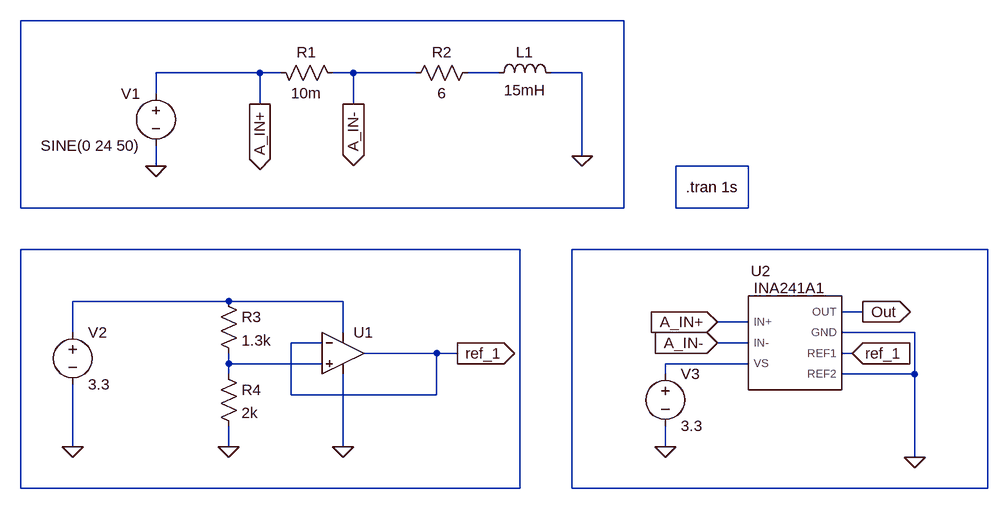
[diagram p0: schematic schematic.asc]
schematic.asc, the LTspice schematic file:
Version 4.1
SHEET 1 1492 788
WIRE 800 48 -128 48
WIRE 240 128 80 128
WIRE 272 128 240 128
WIRE 384 128 352 128
WIRE 480 128 384 128
WIRE 608 128 560 128
WIRE 736 128 688 128
WIRE 80 160 80 128
WIRE 240 176 240 128
WIRE 384 176 384 128
WIRE 736 256 736 128
WIRE 80 272 80 240
WIRE 992 272 880 272
WIRE -128 336 -128 48
WIRE 800 336 800 48
WIRE 800 336 -128 336
WIRE 880 336 880 272
WIRE 992 336 992 272
WIRE 992 336 880 336
WIRE 640 400 -128 400
WIRE 1360 400 720 400
WIRE 192 480 -48 480
WIRE 368 480 192 480
WIRE 1168 496 1136 496
WIRE 992 512 944 512
WIRE -48 528 -48 480
WIRE 368 528 368 480
WIRE 1248 528 1136 528
WIRE 336 544 288 544
WIRE 992 544 944 544
WIRE 512 560 400 560
WIRE 544 560 512 560
WIRE 1152 560 1136 560
WIRE 192 576 192 560
WIRE 336 576 192 576
WIRE 992 576 864 576
WIRE 192 592 192 576
WIRE 864 592 864 576
WIRE 1248 592 1248 528
WIRE 1248 592 1136 592
WIRE 288 624 288 544
WIRE 512 624 512 560
WIRE 512 624 288 624
WIRE -48 704 -48 608
WIRE 192 704 192 672
WIRE 368 704 368 592
WIRE 864 704 864 672
WIRE 1248 720 1248 592
WIRE -128 768 -128 400
WIRE 640 768 640 400
WIRE 640 768 -128 768
WIRE 720 768 720 400
WIRE 1360 768 1360 400
WIRE 1360 768 720 768
FLAG 80 272 0
FLAG 736 256 0
FLAG 240 176 A_IN+
IOPIN 240 176 Out
FLAG 384 176 A_IN-
IOPIN 384 176 Out
FLAG -48 704 0
FLAG 192 704 0
FLAG 544 560 ref_1
IOPIN 544 560 Out
FLAG 368 704 0
FLAG 1248 720 0
FLAG 944 512 A_IN+
IOPIN 944 512 In
FLAG 944 544 A_IN-
IOPIN 944 544 In
FLAG 1152 560 ref_1
IOPIN 1152 560 In
FLAG 1168 496 Out
IOPIN 1168 496 Out
FLAG 864 704 0
SYMBOL voltage 80 144 M0
WINDOW 123 0 0 Left 0
WINDOW 39 0 0 Left 0
SYMATTR InstName V1
SYMATTR Value SINE(0 24 50)
SYMBOL res 256 112 M90
WINDOW 0 0 56 VBottom 2
WINDOW 3 32 56 VTop 2
SYMATTR InstName R1
SYMATTR Value 10m
SYMBOL res 576 112 R90
WINDOW 0 0 56 VBottom 2
WINDOW 3 32 56 VTop 2
SYMATTR InstName R2
SYMATTR Value 6
SYMBOL ind 592 144 R270
WINDOW 0 32 56 VTop 2
WINDOW 3 5 56 VBottom 2
SYMATTR InstName L1
SYMATTR Value 15mH
SYMBOL voltage -48 512 R0
WINDOW 123 0 0 Left 0
WINDOW 39 0 0 Left 0
SYMATTR InstName V2
SYMATTR Value 3.3
SYMBOL res 176 464 R0
SYMATTR InstName R3
SYMATTR Value 1.3k
SYMBOL res 176 576 R0
SYMATTR InstName R4
SYMATTR Value 2k
SYMBOL OpAmps\\UniversalOpAmp 368 560 R0
SYMATTR InstName U1
SYMBOL INA214\\INA241A1 1056 544 R0
WINDOW 0 -45 -95 Bottom 2
WINDOW 3 -1 -100 Top 2
SYMATTR InstName U2
SYMBOL voltage 864 576 R0
WINDOW 123 0 0 Left 0
WINDOW 39 0 0 Left 0
SYMATTR InstName V3
SYMATTR Value 3.3
TEXT 896 304 Left 2 !.tran 1s

The netlist it stands for:
* schematic.asc
V1 A_IN+ 0 SINE(0 24 50)
R1 A_IN+ A_IN- 10m
R2 N002 A_IN- 6
L1 N002 0 15mH
V2 N006 0 3.3
R3 N006 N007 1.3k
R4 N007 0 2k
X§U1 N007 ref_1 N006 0 ref_1 level1 Avol=1Meg GBW=10Meg Vos=0 En=0 Enk=0 In=0 Ink=0 Rin=500Meg  ; pins In+ In- V+ V- OUT
X§U2 A_IN+ A_IN- N008 Out 0 ref_1 0 INA241A1  ; pins IN+ IN- VS OUT GND REF1 REF2
V3 N008 0 3.3
.tran 1s
.lib UniversalOpAmp1.lib
.lib C:\Users\WBowl\Documents\Work\OpenLSM\03_boards\00_bridge_driver\02_detailed_design\01_simulation\current_sensing\INA214\INA241A1.lib
.backanno
.end